# Altium project Ventilation_bathroom.PrjPcb
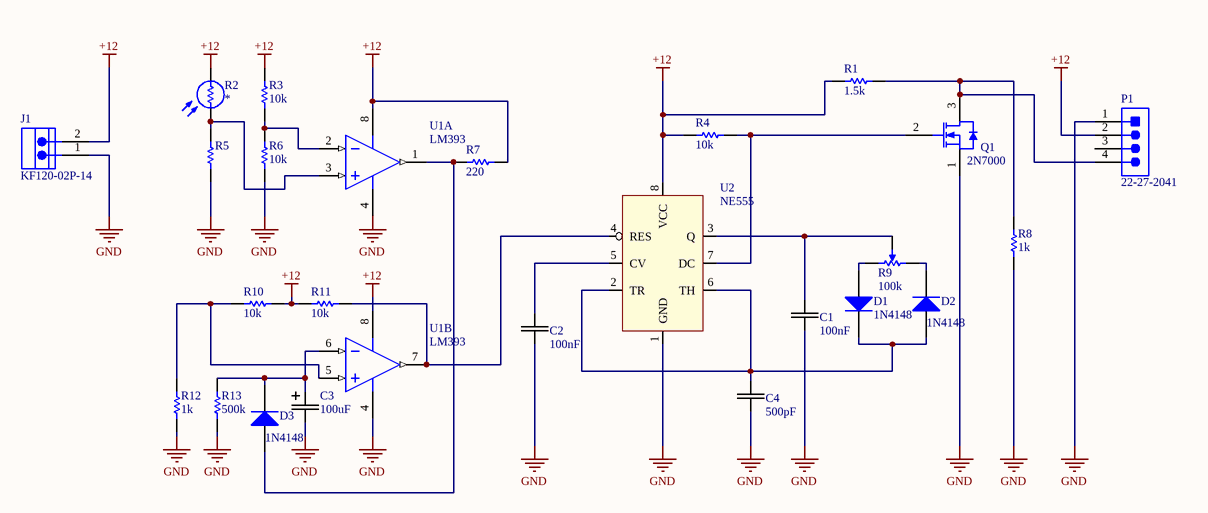
[diagram p0: Schematic.SchDoc]
1 sheet, 25 parts. Net scope: global (net labels, ports and power ports of the same name join across sheets).
Board file: PCB.PcbDoc

## Sheet Schematic.SchDoc
size A4

### Parts
C1  Val: 100nF  [CAP_CERAM]  (hidden comment: CAP_CERAM)
C2  Val: 100nF  [CAP_CERAM]  (hidden comment: CAP_CERAM)
C3  Val: 100uF  [CAP_ELEC_8*11]  (hidden comment: CAP_ELEC_8*11)
C4  Val: 500pF  [CAP_CERAM]  (hidden comment: CAP_CERAM)
D1  1N4148  [DO-41]
D2  1N4148  [DO-41]
D3  1N4148  [DO-41]
J1  KF120-02P-14  [DG301-5.0-02P-1X]
P1  22-27-2041  [MOLX-22-27-2041_V]
Q1  2N7000  [TO-92A]
R1  Val: 1.5k  [RES-0.125]  (hidden comment: RES-0.125)
R2  Photoresistor  [Photoresistor]  (value not drawn)
R3  Val: 10k  [RES-0.125]  (hidden comment: RES-0.125)
R4  Val: 10k  [RES-0.125]  (hidden comment: RES-0.125)
R5  RES-0.125  [RES-0.125]  (value not drawn)
R6  Val: 10k  [RES-0.125]  (hidden comment: RES-0.125)
R7  Val: 220  [RES-0.125]  (hidden comment: RES-0.125)
R8  Val: 1k  [RES-0.125]  (hidden comment: RES-0.125)
R9  value 100k  [BOUR-3362P]  (hidden comment: 3296W)
R10  Val: 10k  [RES-0.125]  (hidden comment: RES-0.125)
R11  Val: 10k  [RES-0.125]  (hidden comment: RES-0.125)
R12  Val: 1k  [RES-0.125]  (hidden comment: RES-0.125)
R13  Val: 500k  [RES-0.125]  (hidden comment: RES-0.125)
U1  LM393  [SO-8_N]  (parts A,B of 2)
U2  NE555  [SOIC8]

### Nets
+12: J1.2 P1.2 R1.2 R2.2 R3.2 R4.1 R7.2 R10.2 R11.1 U1.8(V+) U2.8(VCC)
GND: C1.1 C2.1 C3.1 C4.1 J1.1 P1.1 Q1.1(S) R5.1 R6.1 R8.1 R12.1 R13.1 U1.4(GND) U2.1(GND)
NetC1_2: C1.2 R9.2 U2.3(Q)
NetC2_2: C2.2 U2.5(CV)
NetC3_2: C3.2 D3.1(K) R13.2 U1.6(INB-)
NetC4_2: C4.2 D1.1(K) D2.2(A) U2.2(TR) U2.6(TH)
NetD1_2: D1.2(A) R9.3
NetD2_1: D2.1(K) R9.1
NetD3_2: D3.2(A) R7.1 U1.1(OUTA)
NetP1_4: P1.4 Q1.3(D) R1.1 R8.2
NetQ1_2: Q1.2(G) R4.2 U2.7(DC)
NetR2_1: R2.1 R5.2 U1.3(INA+)
NetR3_1: R3.1 R6.2 U1.2(INA-)
NetR10_1: R10.1 R12.2 U1.5(INB+)
NetR11_2: R11.2 U1.7(OUTB) U2.4(RES)

Not connected (* = marked no-connect by the designer): P1 3

### Library data of the parts
C1 C2 C4 = CAP_CERAM: Ceramic capacitor
C3 = CAP_ELEC_8*11: Electrolitic capacitor
D1-D3 = 1N4007: 1 A Rectifier Diode, 1000 V, -65 to 175 degC, 2-Pin DO-214AC; Manufacturer: Kesenes; CD: 15 pF; VF: 1.1 V; VPK: 1000 V; IR DC: 0.05 mA; IFSM: 30 A; ComponentLink2Description: Datasheet; ComponentLink3URL: http://www.kesenes.com/PDF/1n4001-1n4007.pdf; PartNumber: 1N4007; PackageReference: DO-214AC-2; Mounting Technology: Surface Mount; PackageVersion: Mar-06; ComponentLink1Description: Manufacturer URL; ComponentLink2URL: http://www.kesenes.com/PDF/1n4001-1n4007.pdf; Operating Temperature Range: -65 to 175 degC; ComponentLink3Description: Package Specification; DatasheetVersion: Mar-06; PackageDescription: 2-Pin SMD, Body 4.2925 x 2.6925 mm, Height 2.438 mm; ComponentLink1URL: http://www.kesenes.com/
J1 = Terminal_2: Euro Terminal Block, 6 A, 150 V, -40 to 105 degC, Pitch 2.54 mm, 1x2 Position, Height 8.6 mm, Tail Length 3.3 mm; Manufacturer: Cixi KaiFeng; Rated Current: 6 A; Contact: Brass; Insulation Resistance: 5000 MOhm / 1000 V; Rated Voltage: 150 V; No. of Pole: 2; Withstanding Voltage: AC 1500 V / 1 Min; Contact Resistance: 20 mOhm; Pitch: Single Pitch; PackageReference: KF120-2; Color: Green; Mounting Technology: Through Hole; PartNumber: KF120-02P-14; PackageDescription: Terminal Block, Pitch 2.54 mm, 1 x 2 Position, Height 8.6 mm, Tail Length 3.3 mm; ComponentLink2Description: Datasheet; ComponentLink1Description: Manufacturer URL; ComponentLink2URL: http://www.nb-kaifeng.com/upload/editor/ext_pdf/201305290533202245.pdf; Temp. Range: -40 to 105 degC; ComponentLink1URL: http://www.nb-kaifeng.com/
P1 = Molex 1x4 2.54 FAN: Male Header, Pitch 2.54 mm, 1 x 4 Position, Height 11.7 mm, Tail Length 3.56 mm, RoHS, Bulk; Manufacturer: Molex; Voltage rating: 250V; Current rating: 4A; Datasheet Version: Rev. F, 06/2009; Operating temperature: 0degCto+75degC; Contact material: Tinplatedbrass; Manufacturer URL: http://www.molex.com/; Housing material: Nylon(UL94V-0); Datasheet URL: http://www.molex.com/pdm_docs/sd/022272041_sd.pdf
Q1 = 2N7000: Small Signal MOSFET / 200 mAmps, 60 Volts; Manufacturer: International Rectifier; Drain-to-Source Voltage [Vdss]: 20V; Drain-Source On Resistance-Max: 0.045O; Qg Gate Charge: 8nC; Rated Power Dissipation: 1.25W; Channel Type: N-Channel; Package Reference: SOT-23-3; Manufacturer URL: http://internationalrectifier.com/; Package Description: 3-Pin Small Outline Transistor, Body 2.92 x 1.3 mm, Pitch 0.95 mm; Datasheet Version: Apr-14; Datasheet URL: https://datasheet.ciiva.com/6383/irlml2502pbf-6383216.pdf
R2 = Photoresistor: PR; Val: *
R9 = Potentiometer: 3296 - 3/8 ” Square Trimpot(R) Trimming Potentiometer,, +/- 10%, 0.5 W, -55 to 125 degC, 3-Pin THD, RoHS, Tube
U1 = LM393: Low Power Low Offset Voltage Dual Comparator, 8-pin Narrow SOIC, Pb-Free; Manufacturer: Texas Instruments; CompType: Amplifiers; PackageTopMarking: NSZXTT*LM*393M; PowerWise: N; PackageDescription: SOIC Narrow, 4.9 x 3.9 x 1.45mm, 8 Lead, 1.27mm Pitch; ComponentLink1URL: http://www.ti.com/general/docs/lit/getliterature.tsp?genericPartNumber=LM393-N&fileType=pdf; ComponentLink1Description: Datasheet URL; PinCount: 8; RoHS: Y; Code_IPC: SOIC127P600-8; Package Reference: D0008A; Code_JEDEC: MS-012-AA
U2 = NE555: NE555, DIP-8